# Altium schematic sheet 01_COVER.SchDoc
size 297 x 209 mm
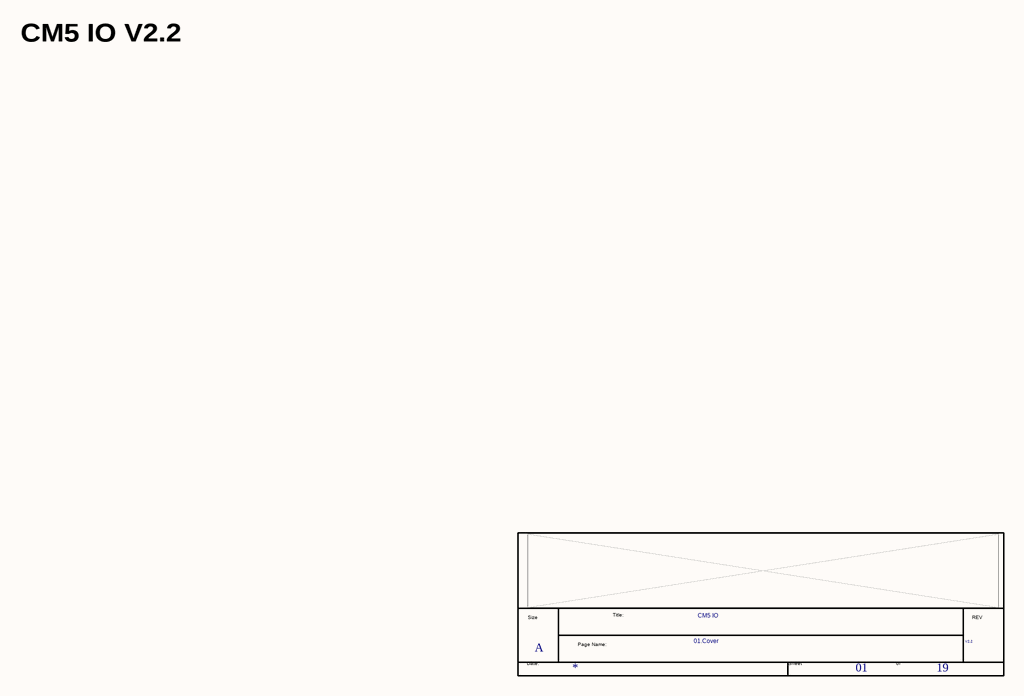
[diagram p0: 01_COVER.SchDoc]

## Parts
*  Doc: 01.Cover  RevCode: V2.2  Title: CM5 IO  Page Size: A  Page Number: 01  Page Count: 19  (hidden comment: radxa_1010)  (graphical)

## Notes on the sheet
- CM5 IO V2.2
- (in symbol radxa_1010) Size; Title:; REV; Page Name:; Date:; Sheet; of

## Library data of the parts
* = radxa_1010: Page Create Date: March  8, 1995; Page Modify Date: *